# Altium schematic sheet FULL_CB_PowerSupply_REV_C.SchDoc
size A4
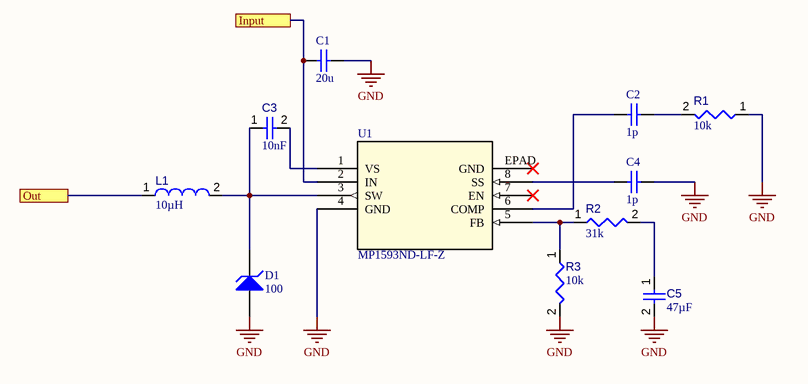
[diagram p0: FULL_CB_PowerSupply_REV_C.SchDoc]

## Parts
C1  value 20u  (hidden comment: Capacitor)
C2  value 1p  (hidden comment: Capacitor)
C3  value 10nF  [CAPC0402(1005)60_L]  (hidden comment: Capacitor 10nF +/-20% 50V 0402)
C4  value 1p  (hidden comment: Capacitor)
C5  value 47µF  [CAPC0805(2012)145_L]  (hidden comment: Capacitor 47µF +/-40% 6.3V 0805)
D1  BV: 100  (hidden comment: Zener Diode)
L1  value 10µH  [INDR62-500-1100X850X1100]  (hidden comment: RL622-100K-RC)
R1  value 10k  [RESC1005X40X25ML05T05]  (hidden comment: Resistor 10k +/-1% 0402 63 mW)
R2  value 31k  [RESC1005X40X25ML05T05]  (hidden comment: Resistor 10k +/-1% 0402 63 mW)
R3  value 10k  [RESC1005X40X25ML05T05]  (hidden comment: Resistor 10k +/-1% 0402 63 mW)
U1  MP1593ND-LF-Z  [MP1593DN-LF-Z]

## Ports
Input, Out

## Nets
GND: C1.2 C4.2 C5.2 D1.1(A) R1.1 R3.2 U1.4(GND)
Input: C1.1 U1.2(IN) ; port Input
Out: L1.1 ; port Out
NetC2_1: C2.1 U1.6(COMP)
NetC2_2: C2.2 R1.2
NetC3_1: C3.1 D1.2(K) L1.2 U1.3(SW)
NetC3_2: C3.2 U1.1(VS)
NetC4_1: C4.1 U1.8(SS)
NetC5_1: C5.1 R2.2
NetR2_1: R2.1 R3.1 U1.5(FB)

Not connected (* = marked no-connect by the designer): U1 7(EN)* EPAD(GND)*

## Library data of the parts
C1 C2 C4 = Capacitor: SimulationGenericComponent: True
C3 = CMP-001-00069-3: Chip Capacitor, 10nF +/-20%, 50V, 0402, Thickness 0.6 mm; Tolerance: 5%; Max Operating Temperature: 85°C; Pins: 2; Case/Package: 0402; Voltage Rating: 50V; Min Operating Temperature: -55°C; Mounting Technology: SMT
C5 = CMP-001-00082-4: Chip Capacitor, 47µF +/-40%, 6.3V, 0805, Thickness 1.45 mm; Tolerance: 10%; Min Operating Temperature: -55°C; Max Operating Temperature: 85°C; Case/Package: 0805; Pins: 2; Mounting Technology: SMT; Voltage Rating: 6.3V
D1 = Zener Diode: AF: 1; BV_MAX: 1e99; CJO: 0; EG: 1.11; FC: 0.5; IBV: 0.001; IS: 1e-14; MJSW: 0.33; NTUN: 30; TNOM: 27; XTI: 3; SimulationGenericComponent: True; CJP: 0; CTA: 0; CTP: 0; FCS: 0.5; FV_MAX: 1e99; IKF: 0; IKR: 0; ISR: 1e-14; JSW: 0; JTUN: 0; JTUNSW: 0; KEG: 1; KF: 0; LEVEL: 1; N: 1; NBV: 1; NR: 1; NS: 1; PHP: 1; RS: 0; TCV: 0; TLEV: 0; TLEVC: 0; TM1: 0; TM2: 0; TPB: 0; TPHP: 0; TRS: 0; TRS2: 0; TT: 0; TTT1: 0; TTT2: 0; VJ: 1; XTITUN: 3
L1 = CMP-006-00012-6: Radial Inductor, 10 uH, +/- 10%, 3 A, -55 to 105 degC, 2-Pin THD, RoHS, Bulk; Manufacturer: Bourns; Resistance: 0.045Ohm; Core Material: Ferrite; Current Rating: 3A; Shielding: Unshielded; Self Resonant Frequency: 14MHz; Q Factor: 50; Lead Pitch: 5mm; Min Operating Temperature: -55°C; Datasheet URL: http://www.bourns.com/docs/Product-Datasheets/rl622_series.pdf; Datasheet Version: Aug-10; Package Reference: INDR62-500-1100X850X1100; Package Description: 2-Pin Radial Lead, Dia 8.5 mm, Pitch 5 mm; Package Quantity: 100; Packaging: Bulk; Mounting Technology: TH; Case/Package: Radial; Pins: 2; Inductance Tolerance: 10%; Tolerance: 10%; Diameter: 8.5mm; Max Operating Temperature: 105°C; RoHS Compliant: True
R1-R3 = CMP-009-00019-5: Chip Resistor, 10 KOhm, +/- 1%, 63 mW, -55 to 155 degC, 0402 (1005 Metric); Power: 63mW; Voltage Rating: 50V; Case/Package: 0402; Mounting Technology: SM; Pins: 2; Min Operating Temperature: -55°C; Tolerance: 1%; RoHS Compliant: True; Max Operating Temperature: 155°C
U1 = Component_1